# EAGLE design masterclock (EAGLE 7.7.0)
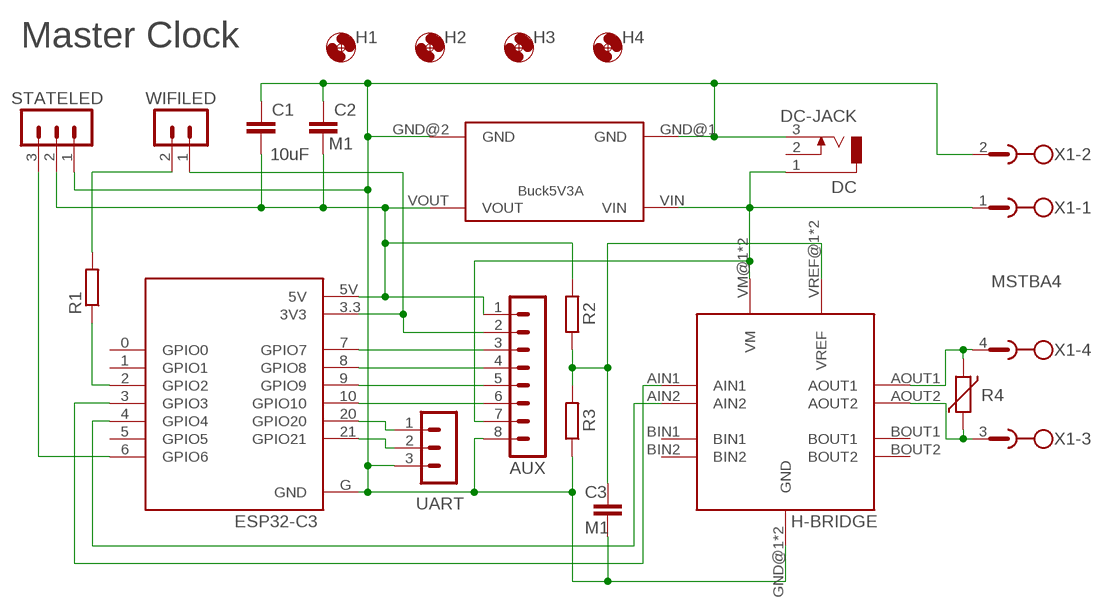
[diagram p0: schematic, sheet 1]

## Parts
AUX  CON-LSTB_MA08-108  [CON-LSTB-MA08-1-NS08]
C1  10uF  C-EUC1206  [C1206]
C2  M1  C-EUC0805  [C0805]
C3  M1  C-EUC0805  [C0805]
DC  DC-JACK  [DCJ0202]
ESP32-C3  ESP32-C3_SUPERMINI  [ESP32-C3_SUPERMINI_MODULE_ESP32-C3_SUPERMINI]
H1  MOUNT-HOLE3,0-2,5  [3,0-2,5]
H2  MOUNT-HOLE3,0-2,5  [3,0-2,5]
H3  MOUNT-HOLE3,0-2,5  [3,0-2,5]
H4  MOUNT-HOLE3,0-2,5  [3,0-2,5]
H-BRIDGE  A4950_MODULE  [A4950_MODULE]
R1  R-EU_R0805  [R0805]
R2  R-EU_R0805  [R0805]
R3  R-EU_R0805  [R0805]
R4  VARISTORS07KS07K385  [S07K385]
STATELED  CON-LSTB_MA03-108  [CON-LSTB_MA03-1-NS08]
U$3  BUCK5V3A  [BUCK5V3A]
UART  CON-LSTB_MA03-108  [CON-LSTB_MA03-1-NS08]
WIFILED  CON-LSTB_MA02-1NS08  [CON-LSTB_MA02-1-NS08]
X1  MSTBA4  [MSTBA4]

## Nets
3V3: AUX.2 ESP32-C3.3.3(3V3) WIFILED.1
5V: AUX.1 C1.2 C2.2 ESP32-C3.5V R2.2 STATELED.2 U$3.VOUT
GND: AUX.8 C1.1 C2.1 C3.2 DC.3 ESP32-C3.G(GND) H-BRIDGE.GND@1(GND) H-BRIDGE.GND@2(GND) R3.1 STATELED.1 U$3.GND@1(GND) U$3.GND@2(GND) UART.3 X1.2
GPIO7: AUX.3 ESP32-C3.7(GPIO7)
GPIO8: AUX.4 ESP32-C3.8(GPIO8)
GPIO9: AUX.5 ESP32-C3.9(GPIO9)
GPIO10: AUX.6 ESP32-C3.10(GPIO10)
N$2: ESP32-C3.2(GPIO2) R1.1
N$4: ESP32-C3.3(GPIO3) H-BRIDGE.AIN1
N$6: ESP32-C3.4(GPIO4) H-BRIDGE.AIN2
N$11: ESP32-C3.6(GPIO6) STATELED.3
N$12: R1.2 WIFILED.2
OUT1: H-BRIDGE.AOUT1 R4.2 X1.4
OUT2: H-BRIDGE.AOUT2 R4.1 X1.3
RX: ESP32-C3.20(GPIO20) UART.1
TX: ESP32-C3.21(GPIO21) UART.2
VIN: AUX.7 DC.1 H-BRIDGE.VM@1(VM) H-BRIDGE.VM@2(VM) U$3.VIN X1.1
VREF: C3.1 H-BRIDGE.VREF@1(VREF) H-BRIDGE.VREF@2(VREF) R2.1 R3.2
Unconnected: DC.2 ESP32-C3.0(GPIO0) ESP32-C3.1(GPIO1) ESP32-C3.5(GPIO5) H-BRIDGE.BIN1 H-BRIDGE.BIN2 H-BRIDGE.BOUT1 H-BRIDGE.BOUT2

## Notes on the sheet
- Master Clock

## Library data of the parts
AUX = masterclock:CON-LSTB_MA08-1
C1-C3 = rcl:C-EU: CAPACITOR, European symbol
DC = masterclock:DC-JACK: 1737246
ESP32-C3 = masterclock:ESP32-C3_SUPERMINI
H1-H4 = masterclock:MOUNT-HOLE: MOUNTING HOLE with drill center marker
H-BRIDGE = masterclock:A4950_MODULE
R1-R3 = rcl:R-EU_: RESISTOR, European symbol
R4 = masterclock:VARISTORS07K
STATELED UART = masterclock:CON-LSTB_MA03-1
U$3 = masterclock:BUCK5V3A
WIFILED = masterclock:CON-LSTB_MA02-1
X1 = masterclock:MSTBA4: PHOENIX; MF: FARNELL; MPN: 1757268; OC_FARNELL: 3705195; OC_NEWARK: 71C4163

## Board
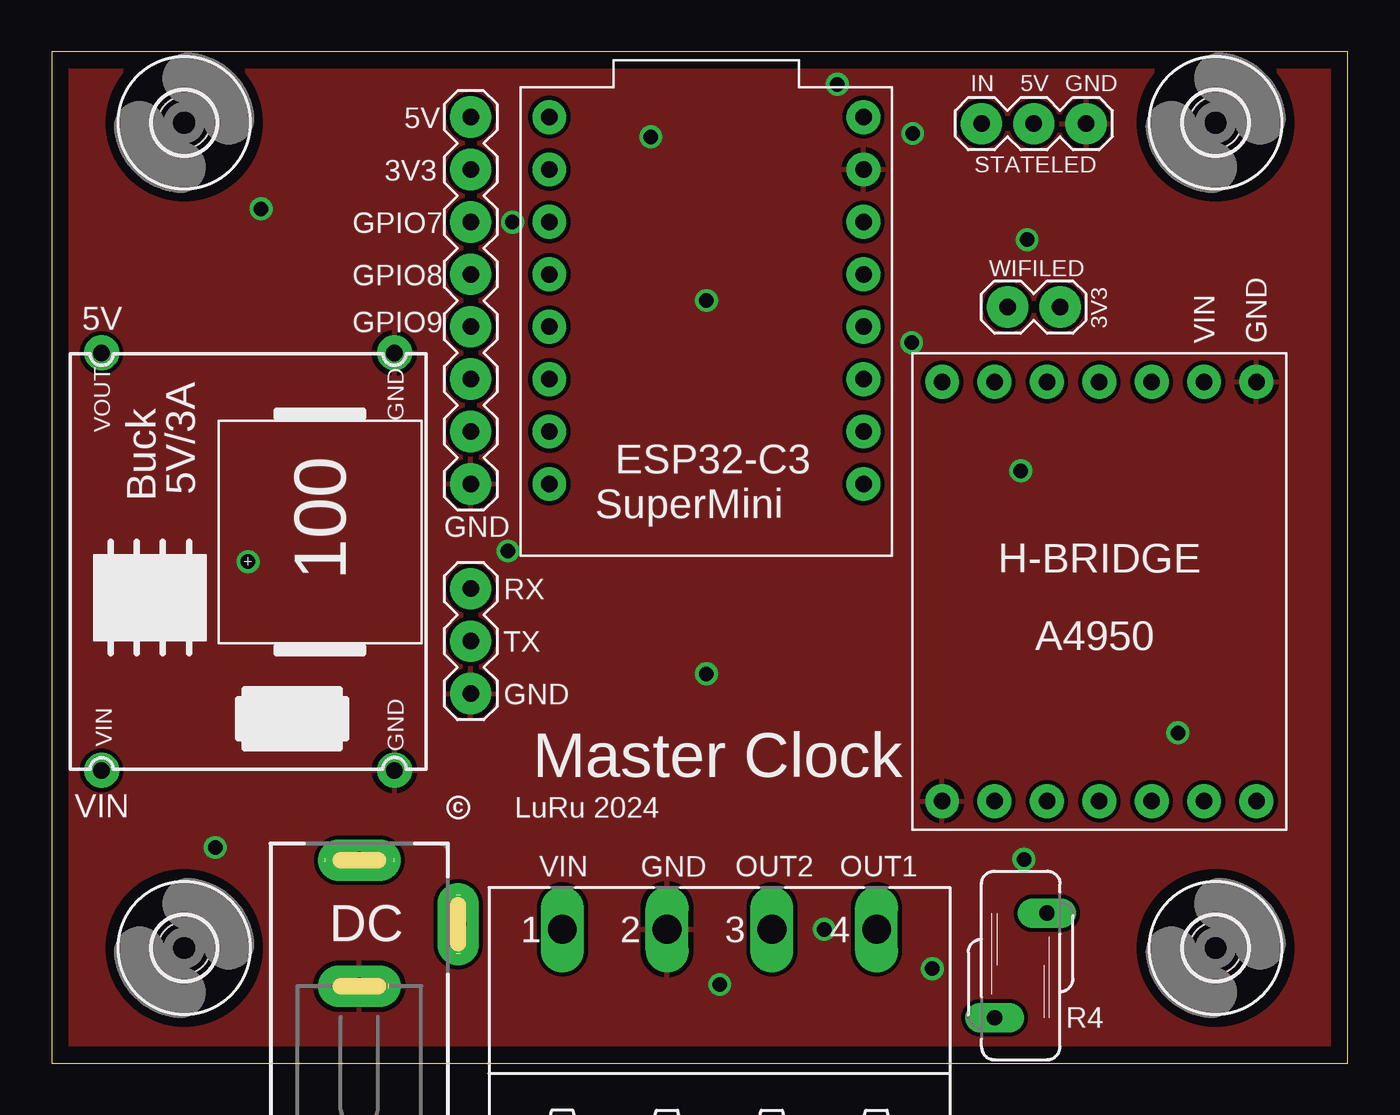
[diagram p1: board, top side]
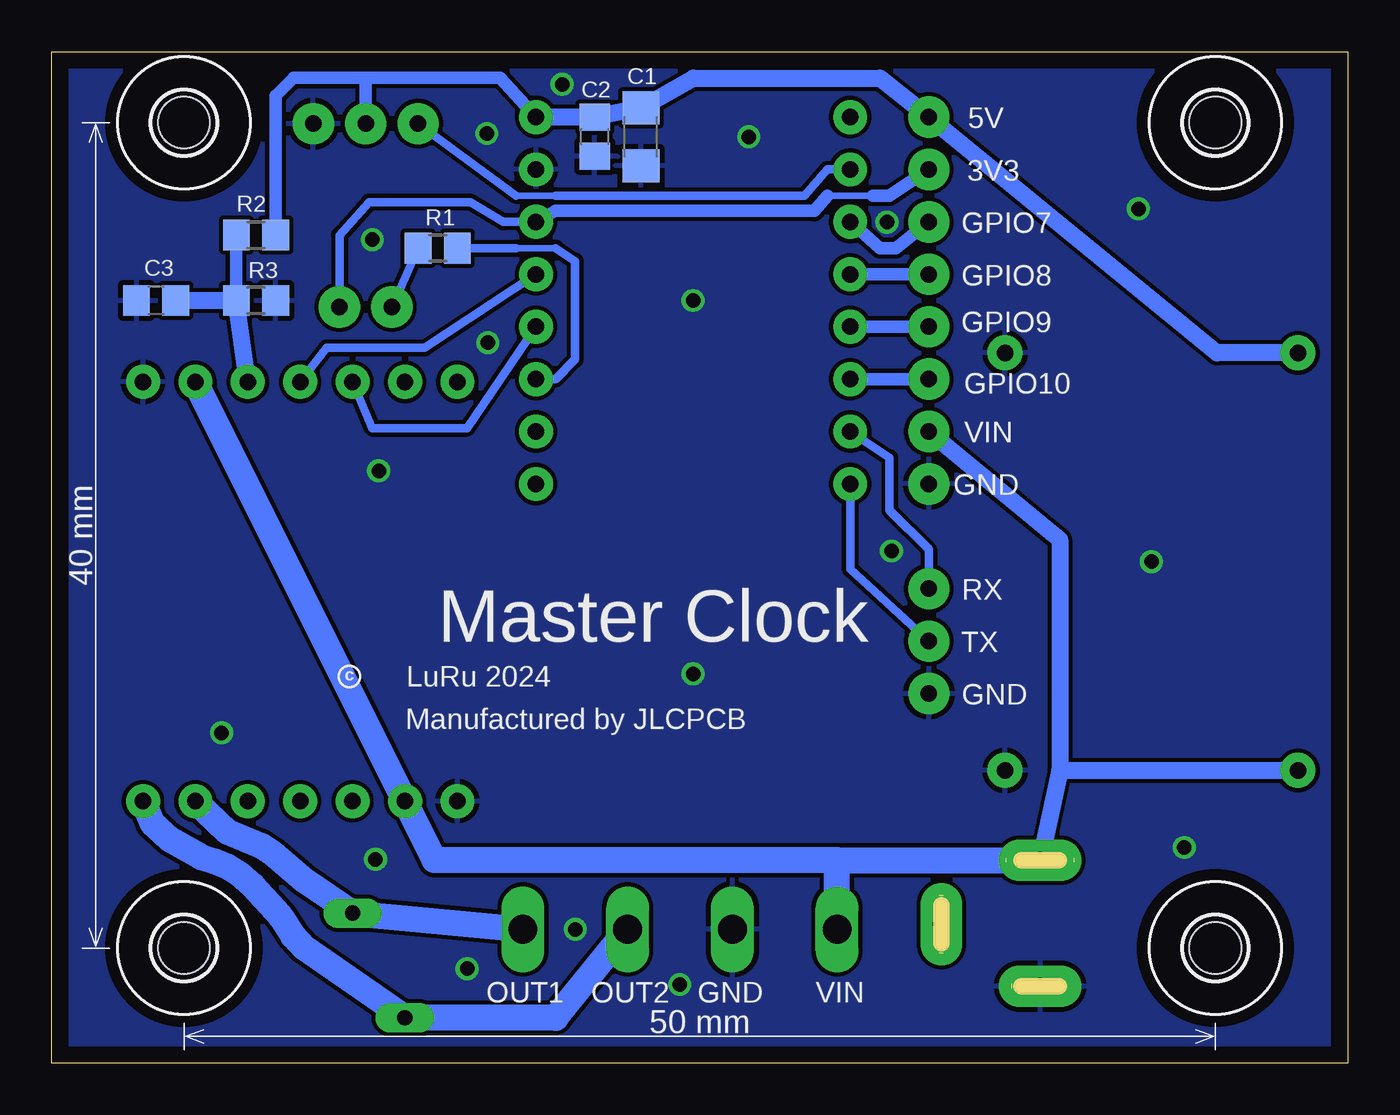
[diagram p2: board, bottom side, seen from below]

Size 62.85 x 49.03 mm. Coordinates in mm from the lower left corner, seen from the top.
Outline: 0,49.03 0,0 62.85,0 62.85,49.03 0,49.03
Copper layers (1*16): Top 0.035mm / dielectric 1.5mm / Bottom 0.035mm
Design rules "default *": minimum track width 10mil, minimum drill 24mil, track to track 8mil, track to pad 8mil, pad to pad 8mil, via to via 8mil, smd to smd 8mil, copper to edge 32mil, drill to drill 8mil, minimum pad ring 10mil, minimum via ring 8mil, stop-mask expansion 4mil, vias tented up to drill 32mil, thermal gap 10mil

### Footprints (pad centres in the part's own frame; a part is rotated, then mirrored left to right if it is on the bottom)
CON-LSTB-MA08-1-NS08 = drill 0.8 pad 2: 1 -8.89,0; 2 -6.35,0; 3 -3.81,0; 4 -1.27,0; 5 1.27,0; 6 3.81,0; 7 6.35,0; 8 8.89,0
C1206 = smd 1.6 x 1.8: 1 -1.4,0; 2 1.4,0
C0805 = smd 1.3 x 1.5: 1 -0.95,0; 2 0.95,0
DCJ0202 = drill 0.8 pad 2 long: 1 0,5.64; 2 4.8,2.54; 3 0,-0.46
ESP32-C3_SUPERMINI_MODULE_ESP32-C3_SUPERMINI = drill 0.8 pad 1.64: 0 8.89,7.62; 1 6.35,7.62; 2 3.81,7.62; 3 1.27,7.62; 3.3 -3.81,7.62; 4 -1.27,7.62; 5 -8.89,-7.62; 5V -8.89,7.62; 6 -6.35,-7.62; 7 -3.81,-7.62; 8 -1.27,-7.62; 9 1.27,-7.62; 10 3.81,-7.62; 20 6.35,-7.62; 21 8.89,-7.62; G -6.35,7.62
3,0-2,5 = hole 2.5: 0,0
A4950_MODULE = drill 0.8 pad 1.64: AIN1 -2.54,10.16; AIN2 0,10.16; AOUT1 5.08,-10.16; AOUT2 7.62,-10.16; BIN1 2.54,-10.16; BIN2 0,-10.16; BOUT1 -5.08,10.16; BOUT2 -7.62,10.16; GND@1 7.62,10.16; GND@2 -7.62,-10.16; VM@1 5.08,10.16; VM@2 -5.08,-10.16; VREF@1 2.54,10.16; VREF@2 -2.54,-10.16
R0805 = smd 1.3 x 1.5: 1 -0.95,0; 2 0.95,0
S07K385 = drill 0.74 pad 1.422 long: 1 -1.27,-2.54; 2 1.27,2.54
CON-LSTB_MA03-1-NS08 = drill 0.8 pad 2: 1 -2.54,0; 2 0,0; 3 2.54,0
BUCK5V3A = drill 0.8 pad 1.7: GND@1 -10.116,-7.1; GND@2 10.116,-7.1; VIN -10.116,7.1; VOUT 10.116,7.1
CON-LSTB_MA02-1-NS08 = drill 0.8 pad 2: 1 -1.27,0; 2 1.27,0
MSTBA4 = drill 1.397 long: 1 -7.62,5.08; 2 -2.54,5.08; 3 2.54,5.08; 4 7.62,5.08

### Placement (x,y rotation side)
AUX  20.32,36.97 270 top
C1  34.28,44.9 90 bottom
C2  36.52,44.9 90 bottom
C3  57.78,36.97 180 bottom
DC  14.92,4.2 0 top
ESP32-C3  31.75,36.97 270 top
H1  56.44,5.58 0 top
H2  6.43,5.58 0 top
H3  56.44,45.59 0 top
H4  6.43,45.59 0 top
H-BRIDGE  50.8,22.86 0 top
R1  44.13,39.51 180 bottom
R2  52.94,40.14 0 bottom
R3  52.94,36.97 180 bottom
R4  46.99,4.74 0 top
STATELED  47.62,45.54 180 top
U$3  9.53,24.31 90 top
UART  20.32,20.45 270 top
WIFILED  47.62,36.65 180 top
X1  32.38,1.41 0 top

### Tracks (layer width: path | path; a pad name or v marks a point on that pad's centre or on a via)
3V3
  Bottom 0.305: 23.02,42.05 25.24,42.05
  Bottom 0.406: ESP32-C3.3.3 40.96,40.77 42.55,41.73 47.47,41.73 48.9,40.14 WIFILED.1
  Bottom 0.61: 23.02,42.05 22.23,42.05 AUX.2 | 25.24,42.05 25.88,41.31 38.42,41.31 ESP32-C3.3.3
5V
  Bottom 0.61: ESP32-C3.5V 41.12,47.76 47.62,47.76 | 47.62,47.76 STATELED.2 | 47.62,47.76 51.12,47.76 51.99,46.89 51.99,40.54 R2.2
  Bottom 0.813: U$3.VOUT 6.35,34.43 AUX.1 22.7,47.74 31.75,47.74 C1.2 C2.2 ESP32-C3.5V
GND  (via drill 0.7)
  other vias: 41.75,45.06 47.15,9.88 46.99,28.71 31.75,36.97 7.94,10.45 32.4,3.81 9.53,24.31 10.16,41.41 47.3,39.92 22.34,40.76 31.75,18.87 22.13,24.83 29.05,44.9 54.61,16.01 38.1,47.44 37.47,6.49 42.7,4.58 41.71,34.92
  pour Bottom: 62.87,0 0,0 0,49.03 62.87,49.03
  pour Top: 62.87,0 0,0 0,49.03 62.87,49.03
GPIO7
  Bottom 0.61: AUX.3 21.91,39.51 22.7,39.51 ESP32-C3.7
GPIO8
  Bottom 0.61: AUX.4 ESP32-C3.8
GPIO9
  Bottom 0.61: AUX.5 ESP32-C3.9
GPIO10
  Bottom 0.61: AUX.6 ESP32-C3.10
N$2
  Bottom 0.305: 40.32,39.51 38.42,39.51
  Bottom 0.406: R1.1 40.32,39.51 | 38.42,39.51 37.47,38.87 37.47,34.11 38.42,33.16 ESP32-C3.2
N$4
  Bottom 0.406: H-BRIDGE.AIN1 47.31,30.77 42.7,30.77 ESP32-C3.3
N$6
  Bottom 0.406: H-BRIDGE.AIN2 49.53,34.67 44.77,34.67 ESP32-C3.4
N$11
  Bottom 0.305: 40.32,42.05 38.42,42.05
  Bottom 0.406: 38.42,42.05 26.35,42.05 25.24,43.31 ESP32-C3.6 | 40.32,42.05 STATELED.3
N$12
  Bottom 0.406: WIFILED.2 R1.2
OUT1
  Bottom 1.27: H-BRIDGE.AOUT1 54.37,11.25 52.73,10.56 52.1,10.15 50.62,8.88 R4.2 X1.4
OUT2
  Bottom 1.27: H-BRIDGE.AOUT2 57.97,11.64 57.12,10.84 55.57,9.97 54.92,9.78 54.33,9.54 53.75,9.17 53.13,8.63 51.75,7.12 51.14,6.16 50.61,5.6 R4.1 38.42,2.2 X1.3
RX
  Bottom 0.406: ESP32-C3.20 22.23,29.34 22.23,26.8 20.32,24.9 UART.1
TX
  Bottom 0.406: UART.2 24.13,23.95 ESP32-C3.21
VIN
  Bottom 0.813: 13.97,14.19 13.97,25.38 AUX.7 | 13.97,14.19 U$3.VIN | 13.97,14.19 DC.1
  Bottom 1.27: X1.1 24.77,9.84 | 24.77,9.84 44.29,9.84 H-BRIDGE.VM@2 H-BRIDGE.VM@1 | 24.77,9.84 DC.1
VREF
  Bottom 0.61: R3.2 R2.1
  Bottom 0.813: H-BRIDGE.VREF@1 R3.2 C3.1

### Text on the board
tNames: IN | 5V | GND | 5V | 3V3 | GPIO7 | GPIO8 | 5V | 3V3 | GPIO9 | VIN | GND | SuperMini | GND | RX | TX | A4950 | GND | Master Clock | LuRu 2024 | VIN | c | VIN | GND | OUT2 | OUT1
bNames: 5V | 3V3 | GPIO7 | GPIO8 | GPIO9 | GPIO10 | VIN | GND | 40 mm | Master Clock | RX | TX | LuRu 2024 | c | GND | Manufactured by JLCPCB | VIN | GND | OUT2 | OUT1 | 50 mm